# EAGLE design main_board (EAGLE 9.6.2)

## Sheet 1 of 2
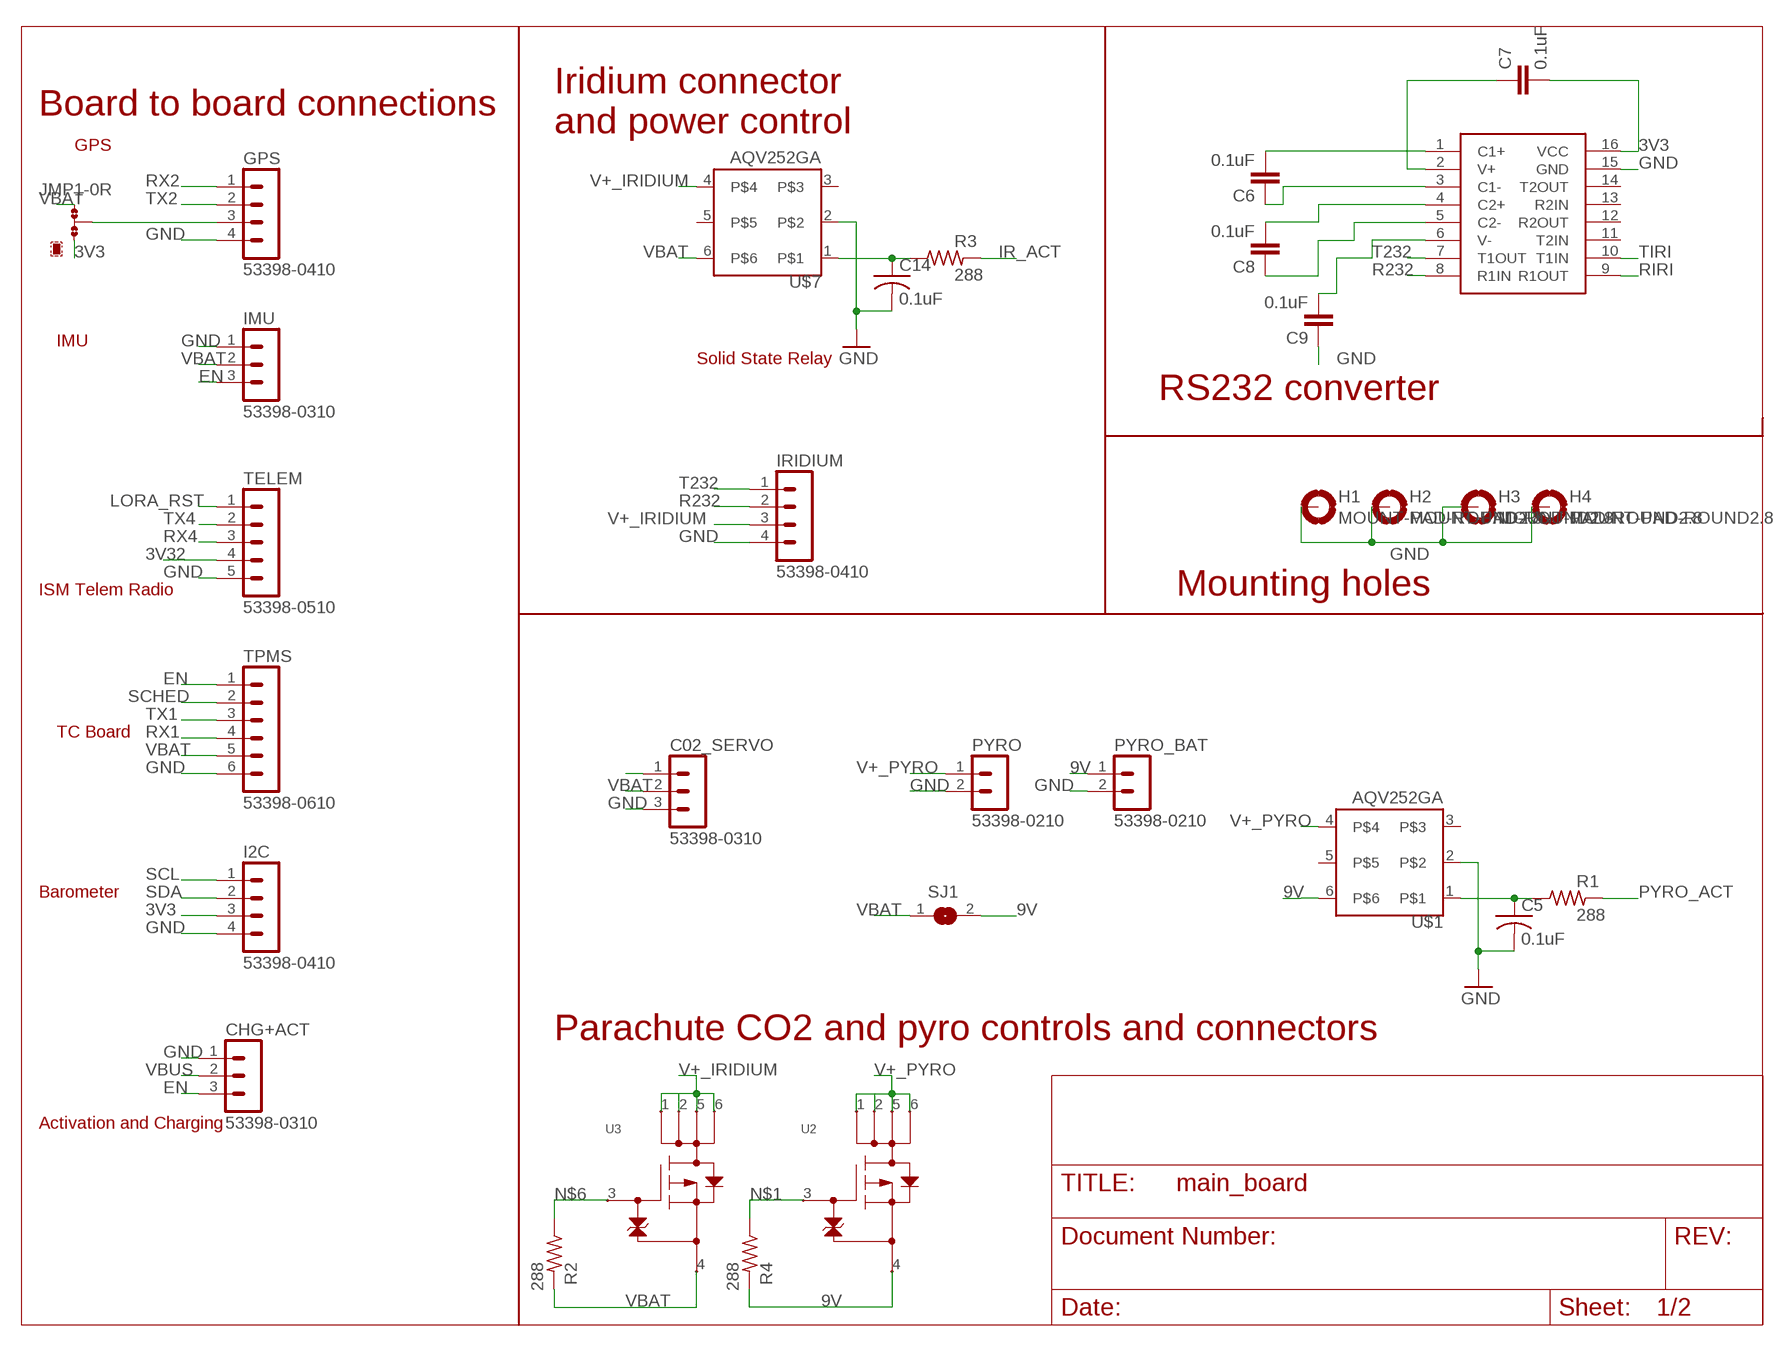
[diagram p0: schematic, sheet 1]

### Parts
C02_SERVO  53398-0310  [53398-0310]
C5  0.1uF  C-USC0603  [C0603]
C6  0.1uF  C-EUC0603  [C0603]
C7  0.1uF  C-EUC0603  [C0603]
C8  0.1uF  C-EUC0603  [C0603]
C9  0.1uF  C-EUC0603  [C0603]
C14  0.1uF  C-USC0603  [C0603]
CHG+ACT  53398-0310  [53398-0310]
GPS  53398-0410  [53398-0410]
H1  MOUNT-PAD-ROUND2.8  [2,8-PAD]
H2  MOUNT-PAD-ROUND2.8  [2,8-PAD]
H3  MOUNT-PAD-ROUND2.8  [2,8-PAD]
H4  MOUNT-PAD-ROUND2.8  [2,8-PAD]
I2C  53398-0410  [53398-0410]
IMU  53398-0310  [53398-0310]
IRIDIUM  53398-0410  [53398-0410]
JMP1  0R-JUMPA  [A0R-JMP]
PYRO  53398-0210  [53398-0210]
PYRO_BAT  53398-0210  [53398-0210]
R1  288  R-US_R0603  [R0603]
R2  288  R-US_R0603  [R0603]
R3  288  R-US_R0603  [R0603]
R4  288  R-US_R0603  [R0603]
SJ1  SJ  [SJ]
TELEM  53398-0510  [53398-0510]
TPMS  53398-0610  [53398-0610]
U2  SSM6J414TU  [UF6_TOS]
U3  SSM6J414TU  [UF6_TOS]
U$1  AQV252GA  [DIP6]
U$2  UM3232EEAE  [RQ_16_ADI]
U$7  AQV252GA  [DIP6]

### Nets
3V3: C7.2 I2C.3 JMP1.3 U$2.16(VCC) ; also sheet 2
3V32: TELEM.4 ; also sheet 2
9V: PYRO_BAT.1 R4.2 SJ1.2 U2.4 U$1.6
CO2_SERVO: C02_SERVO.1 ; also sheet 2
EN: CHG+ACT.3 IMU.3 TPMS.1 ; also sheet 2
GND [gnd]: C02_SERVO.3 C5.2 C9.1 C14.2 CHG+ACT.1 GPS.4 H1.B2,8(MOUNT) H2.B2,8(MOUNT) H3.B2,8(MOUNT) H4.B2,8(MOUNT) I2C.4 IMU.1 IRIDIUM.4 PYRO.2 PYRO_BAT.2 TELEM.5 TPMS.6 U$1.2 U$2.15(GND) U$7.2 ; also sheet 2
IR_ACT: R3.2 ; also sheet 2
LORA_RST: TELEM.1 ; also sheet 2
N$1: C5.1 R1.1 R4.1 U2.3 U$1.1
N$2: GPS.3 JMP1.2
N$5: C6.2 U$2.1(C1+)
N$6: C14.1 R2.1 R3.1 U3.3 U$7.1
N$11: C7.1 U$2.2(V+)
N$12: C6.1 U$2.3(C1-)
N$13: C8.2 U$2.4(C2+)
N$14: C8.1 U$2.5(C2-)
N$15: C9.2 U$2.6(V-)
PYRO_ACT: R1.2 ; also sheet 2
R232: IRIDIUM.2 U$2.8(R1IN)
RIRI: U$2.9(R1OUT) ; also sheet 2
RX1: TPMS.4 ; also sheet 2
RX2: GPS.1 ; also sheet 2
RX4: TELEM.3 ; also sheet 2
SCHED: TPMS.2 ; also sheet 2
SCL: I2C.1 ; also sheet 2
SDA: I2C.2 ; also sheet 2
T232: IRIDIUM.1 U$2.7(T1OUT)
TIRI: U$2.10(T1IN) ; also sheet 2
TX1: TPMS.3 ; also sheet 2
TX2: GPS.2 ; also sheet 2
TX4: TELEM.2 ; also sheet 2
V+_IRIDIUM: IRIDIUM.3 U3.1 U3.2 U3.5 U3.6 U$7.4
V+_PYRO: PYRO.1 U2.1 U2.2 U2.5 U2.6 U$1.4
VBAT: C02_SERVO.2 IMU.2 JMP1.1 R2.2 SJ1.1 TPMS.5 U3.4 U$7.6 ; also sheet 2
VBUS: CHG+ACT.2 ; also sheet 2
Unconnected: U$1.3 U$1.5 U$2.11(T2IN) U$2.12(R2OUT) U$2.13(R2IN) U$2.14(T2OUT) U$7.3 U$7.5

### Notes on the sheet
- Board to board connections
- Iridium connector 
  and power control
- GPS
- IMU
- Solid State Relay
- RS232 converter
- ISM Telem Radio | Mounting holes
- TC Board
- Barometer
- Parachute CO2 and pyro controls and connectors
- Activation and Charging

## Sheet 2 of 2
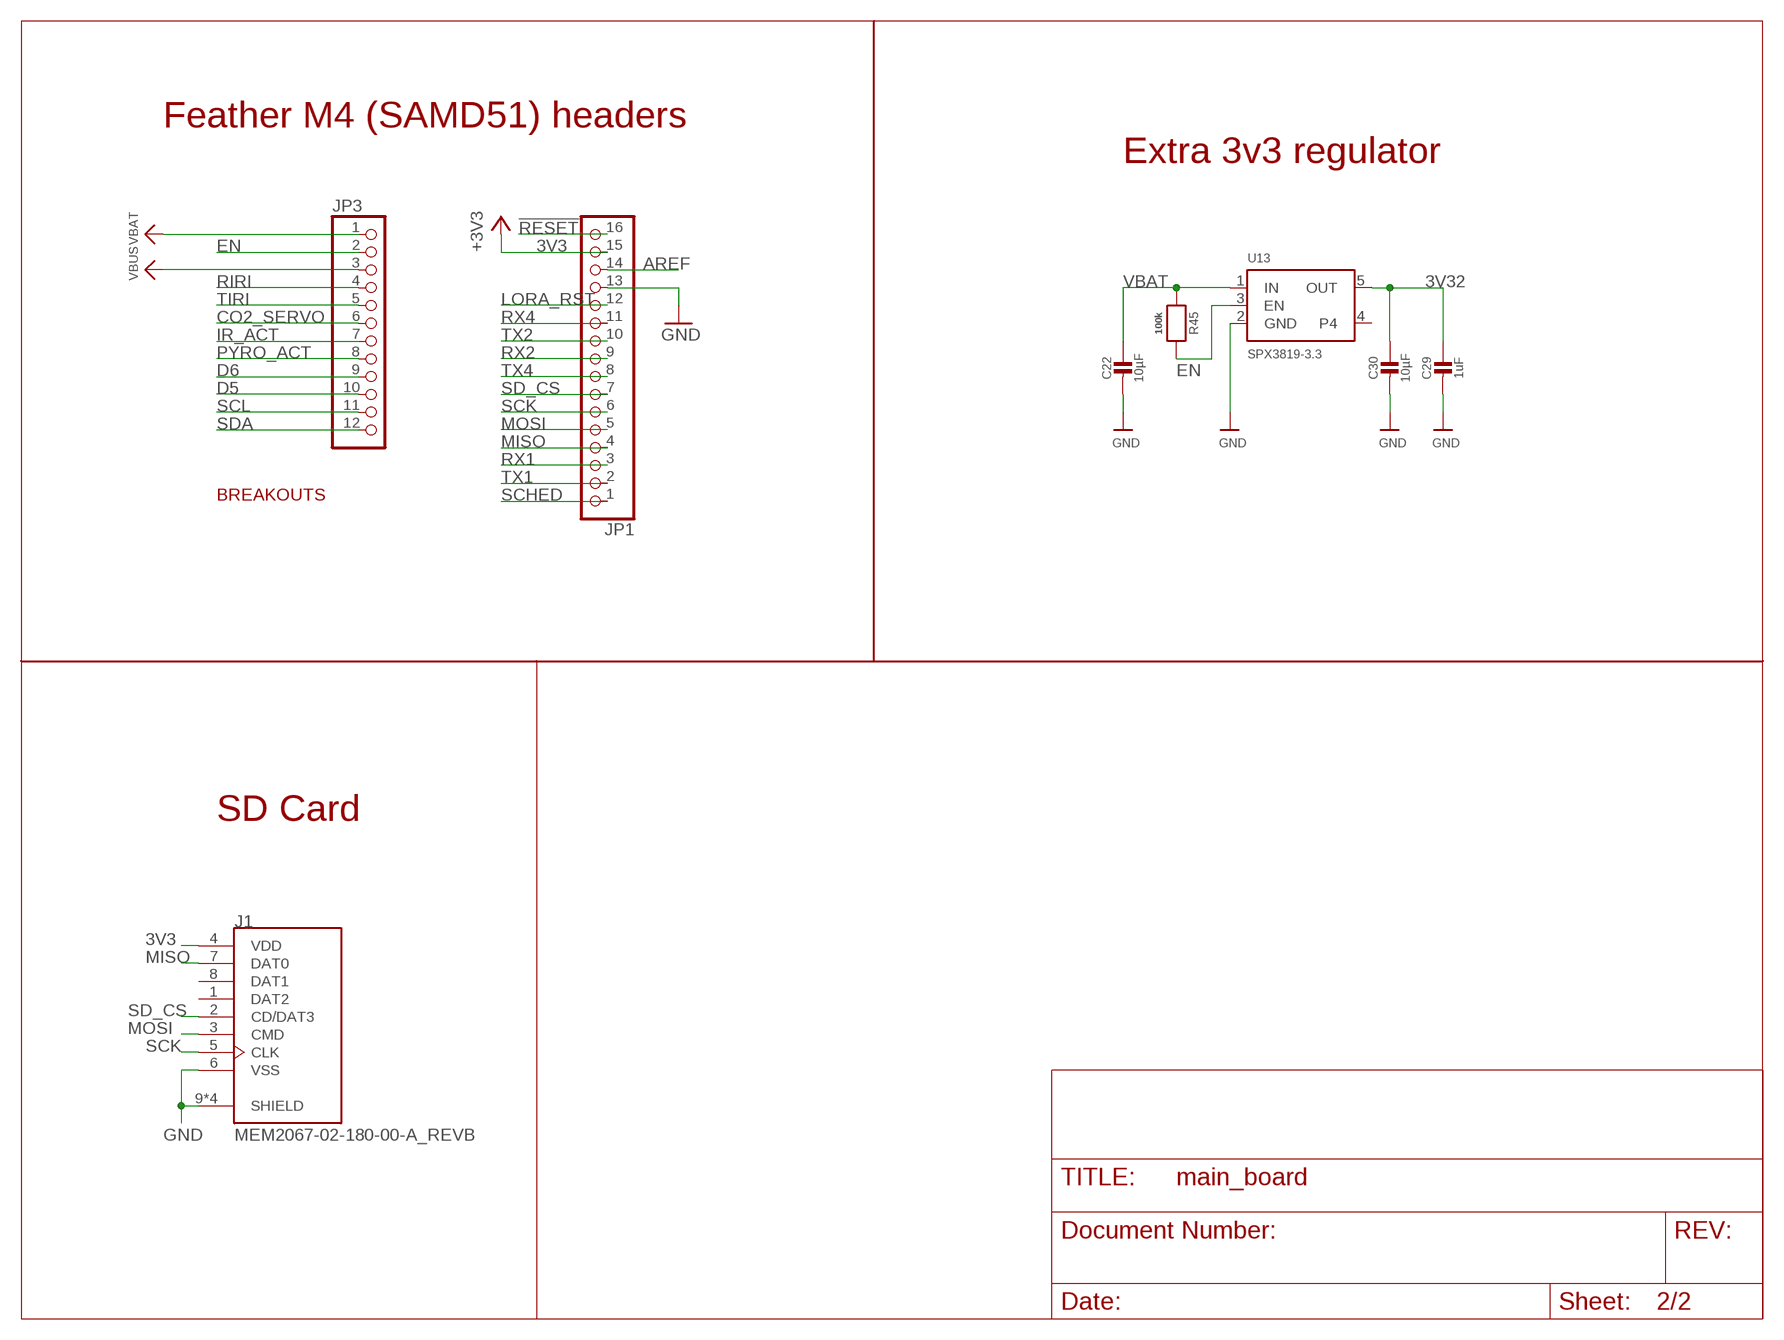
[diagram p1: schematic, sheet 2]

### Parts
C22  10µF  CAP_CERAMIC0805-NOOUTLINE  [0805-NO]
C29  1uF  CAP_CERAMIC0603_NO  [0603-NO]
C30  10µF  CAP_CERAMIC0805-NOOUTLINE  [0805-NO]
J1  MEM2067-02-180-00-A_REVB  [GCT_MEM2067-02-180-00-A_REVB]
JP1  HEADER-1X16ROUND  [1X16_ROUND]
JP3  HEADER-1X12  [1X12_ROUND]
R45  100k  RESISTOR_0603_NOOUT  [0603-NO]
U13  SPX3819-3.3  VREG_SOT23-5  [SOT23-5]

### Nets
3V3: J1.4(VDD) JP1.15 ; supply symbol labelled +3V3 ; also sheet 1
3V32: C29.1 C30.1 U13.5(OUT) ; also sheet 1
!RESET: JP1.16
AREF: JP1.14
CO2_SERVO: JP3.6 ; also sheet 1
D5: JP3.10
D6: JP3.9
EN: JP3.2 R45.2 U13.3(EN) ; also sheet 1
GND [gnd]: C22.2 C29.2 C30.2 J1.6(VSS) J1.9(SHIELD) J1.10(SHIELD) J1.11(SHIELD) J1.12(SHIELD) JP1.13 U13.2(GND) ; also sheet 1
IR_ACT: JP3.7 ; also sheet 1
LORA_RST: JP1.12 ; also sheet 1
MISO: J1.7(DAT0) JP1.4
MOSI: J1.3(CMD) JP1.5
PYRO_ACT: JP3.8 ; also sheet 1
RIRI: JP3.4 ; also sheet 1
RX1: JP1.3 ; also sheet 1
RX2: JP1.9 ; also sheet 1
RX4: JP1.11 ; also sheet 1
SCHED: JP1.1 ; also sheet 1
SCK: J1.5(CLK) JP1.6
SCL: JP3.11 ; also sheet 1
SD_CS: J1.2(CD/DAT3) JP1.7
SDA: JP3.12 ; also sheet 1
TIRI: JP3.5 ; also sheet 1
TX1: JP1.2 ; also sheet 1
TX2: JP1.10 ; also sheet 1
TX4: JP1.8 ; also sheet 1
VBAT: C22.1 JP3.1 R45.1 U13.1(IN) ; also sheet 1
VBUS: JP3.3 ; also sheet 1
Unconnected: J1.1(DAT2) J1.8(DAT1) U13.4

### Notes on the sheet
- Feather M4 (SAMD51) headers
- Extra 3v3 regulator
- BREAKOUTS
- SD Card

## Library data of the parts
C02_SERVO CHG+ACT IMU = con-molex-picoblade:53398-0310: HEADER
C5 C14 = adafruit:C-US: CAPACITOR, American symbol
C6-C9 = rcl:C-EU: CAPACITOR, European symbol; SPICEPREFIX: C
C22 C29 C30 = microbuilder:CAP_CERAMIC: Ceramic Capacitors For new designs, use the packages preceded by an '_' character since they are more reliable: The following footprints should be used on most boards: _0402 - Standard footprint for regular board layouts _0603 - Standard footprint for regular board layouts _0805 - Standard footprint for regular board layouts _1206 - Standard footprint for regular board layouts For extremely tight-pitch boards where space is at a premium, the following 'micro-pitch' footprints can be used (smaller pads, no silkscreen outline, etc.): _0402MP - Micro-pitch footprint for very dense/compact boards _0603MP - Micro-pitch footprint for very dense/compact boards _0805MP - Micro-pitch footprint for very dense/compact boards _1206MP - Micro-pitch footprint for very dense/compact boards
GPS I2C IRIDIUM = con-molex-picoblade:53398-0410: HEADER
H1-H4 = holes:MOUNT-PAD-ROUND: MOUNTING PAD, round
J1 = MEM20267:MEM2067-02-180-00-A_REVB: Micro SD Memory Card ConnectorSMT, Hinged, 1.80mm Profile Check prices <https://pricing.snapeda.com/parts/MEM2067-02-180-00-A/Global%20Connector%20Technology/view-part?ref=eda>; AVAILABILITY: In Stock; DESCRIPTION: 8 Position Card Connector microSD Surface Mount, Right Angle Gold; MF: Global Connector Technology; MP: MEM2067-02-180-00-A; PACKAGE: None; PRICE: None; PURCHASE-URL: https://pricing.snapeda.com/search/part/MEM2067-02-180-00-A/?ref=eda
JMP1 = jump-0r-smd:0R-JUMP: SMD 0R 0805 Jumper
JP1 = microbuilder:HEADER-1X16: PIN HEADER
JP3 = microbuilder:HEADER-1X12
PYRO PYRO_BAT = con-molex-picoblade:53398-0210: HEADER
R1-R4 = adafruit:R-US_: RESISTOR, American symbol
R45 = microbuilder:RESISTOR: Resistors For new designs, use the packages preceded by an '_' character since they are more reliable: The following footprints should be used on most boards: _0402 - Standard footprint for regular board layouts _0603 - Standard footprint for regular board layouts _0805 - Standard footprint for regular board layouts _1206 - Standard footprint for regular board layouts For extremely tight-pitch boards where space is at a premium, the following 'micro-pitch' footprints can be used (smaller pads, no silkscreen outline, etc.): _0402MP - Micro-pitch footprint for very dense/compact boards _0603MP - Micro-pitch footprint for very dense/compact boards _0805MP - Micro-pitch footprint for very dense/compact boards _1206MP - Micro-pitch footprint for very dense/compact boards
SJ1 = jumper:SJ: SMD solder JUMPER
TELEM = con-molex-picoblade:53398-0510: HEADER
TPMS = con-molex-picoblade:53398-0610: HEADER
U2 U3 = ssm6j414tu:SSM6J414TU; COPYRIGHT: Copyright (C) 2021 Ultra Librarian. All rights reserved.; DIGI-KEY_PART_NUMBER_1: SSM6J414TULF(TCT-ND; DIGI-KEY_PART_NUMBER_2: SSM6J414TULF(TDKR-ND; DIGI-KEY_PART_NUMBER_3: SSM6J414TULF(TTR-ND; DIGI-KEY_PART_NUMBER_4: SSM6J414TULFCT-ND; DIGI-KEY_PART_NUMBER_5: SSM6J414TULFDKR-ND; DIGI-KEY_PART_NUMBER_6: SSM6J414TULFTR-ND; MANUFACTURER_PART_NUMBER: SSM6J414TU; MFR_NAME: Toshiba Electronic Devices & Storage Co.
U13 = microbuilder:VREG_SOT23-5: SOT23-5 Fixed Voltage Regulators Part Current Out V Out V In V Dropout θJA (°C/W) TJ (°C) Digikey Part No. ADP121 150mA 3.3V 3.4-5.5V 0.09V @ 150mA -- -- ADP121-AUJZ33R7CT-ND ADP121 150mA 3.0V 3.1-5.5V 0.09V @ 150mA -- -- ADP121-AUJZ30R7CT-ND ADP122 300mA 3.3V 3.4-5.5V 0.085V @ 300mA -- -- ADP122AUJZ-3.3-R7CT-ND ADP1712 300mA 3.3V 3.5-5.5V 0.17V @ 300mA -- -- ADP1712AUJZ-3.3-R7TR-ND AP7311 (Low Cost) 150mA 3.3V 3.5-6V 0.15V @ 150mA -- -- AP7311-33WG-7DICT-ND LD39015M18R 150mA 1.8V 1.9V-5.5V 0.08V @ 100mA -- -- 497-6977-1-ND LP2985A-33DBVR 150mA 3.3V 3.3-16V 0.28V @ 150mA 206 150 296-18479-1-ND MCP1824T-3302E/OT 300mA 3.3V 3.5V-6V 0.2V @ 300mA -- -- MCP1824T-3302E/OTCT-ND MIC5205-2.5YM5 TR 150mA 2.5V 2.7-16V 0.165V @ 150mA -- -- 576-1257-2-ND MIC5205-3.0YM5 TR 150mA 3.0V 3.2V-16V 0.165V @ 150mA -- -- 576-1258-2-ND MIC5205-3.3YM5 TR 150mA 3.3V 3.5V-16V 0.165V @ 150mA -- -- 576-1259-2-ND TPS780330220 150mA 3.3V+2.2V 3.6-5.5V 250mV Max -- -- 296-23332-1-ND TDA3663/N1,135 100mA 3.3V 3.5-45V 0.18V @ 50mA -- -- 568-5343-1-ND Max operating temp can be calculated using θJA, TJ (max junction temperature), and power in watts. Set the "Maximum Ambient Temperature" until it reaches TJ ("Max Junction Temperature"), which is the absolute limit for safe use of the regulator: Heat Sink Temperature Calculator <http://www.daycounter.com/Calculators/Heat-Sink-Temperature-Calculator.phtml> For example, With 12V source into a 3.3V LP2985 and a 30mA load, we are dissipating (12V-3.3V) * 0.03A = 0.261W. With a θJA of 206 °C/W, a TJ of 150°C, and 261mW we can safely use the chip without a heat sink up to 75°C (=147.1°C Junction Temperature).
U$1 U$7 = TI_radio:AQV252GA
U$2 = ADM310:UM3232EEAE

## Net classes
1 power: width 0.305 mm
2 gnd: width 0.254 mm

## Board
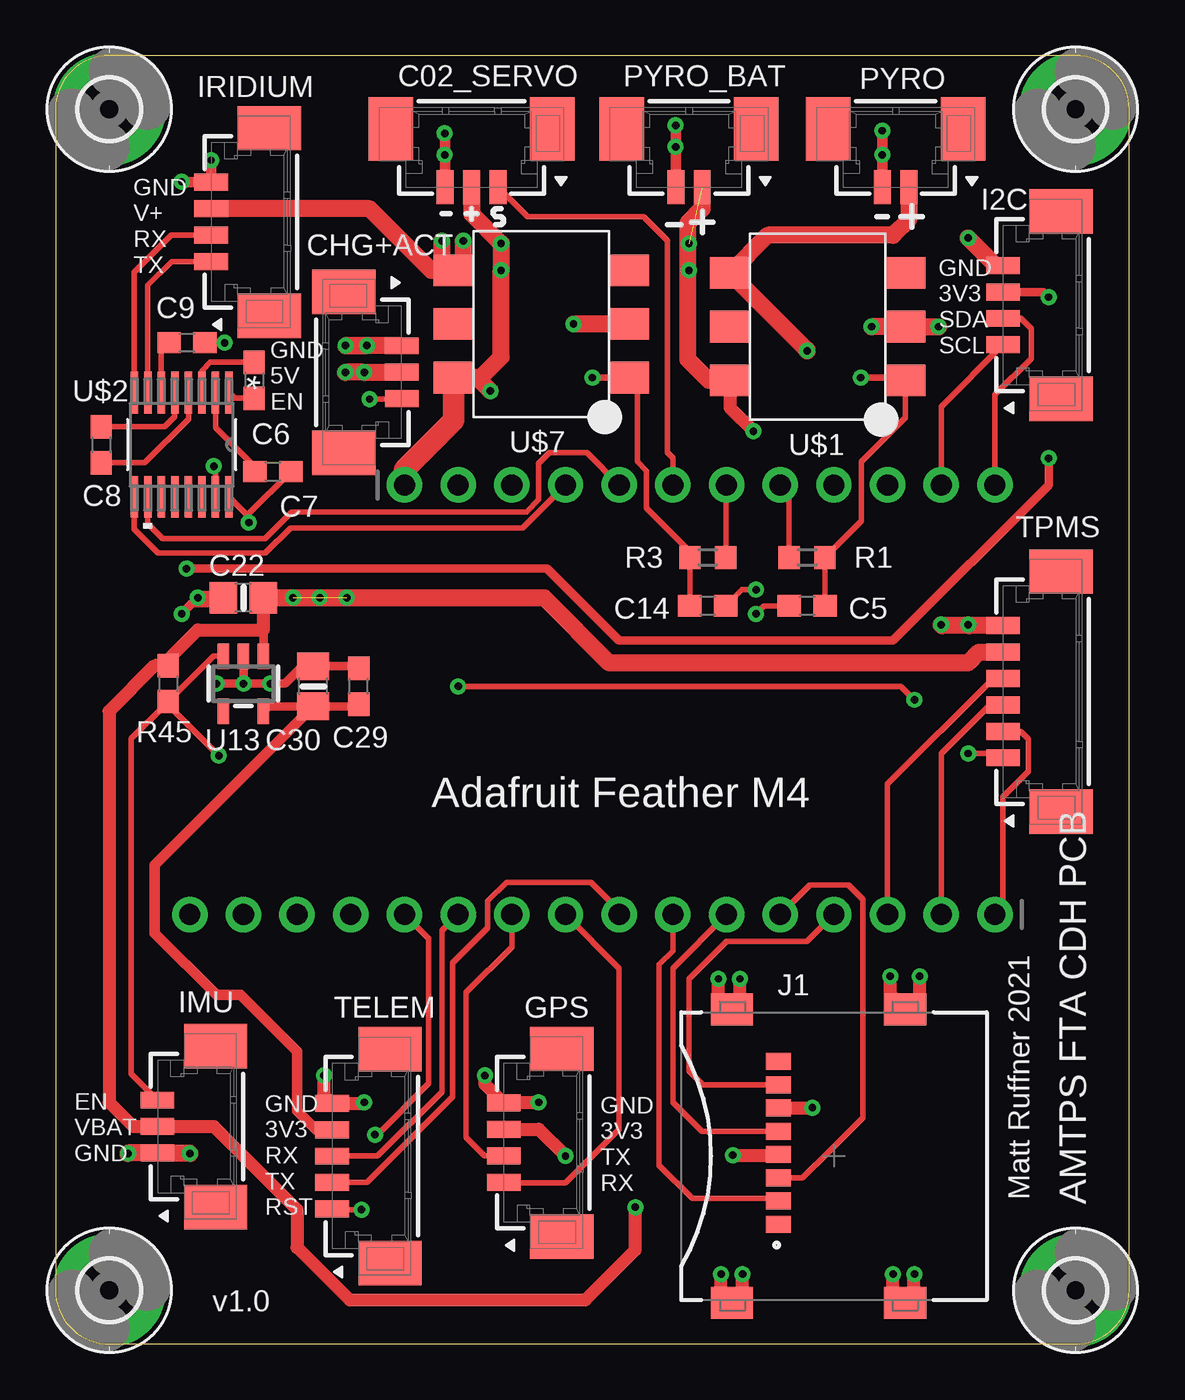
[diagram p2: board, top side]
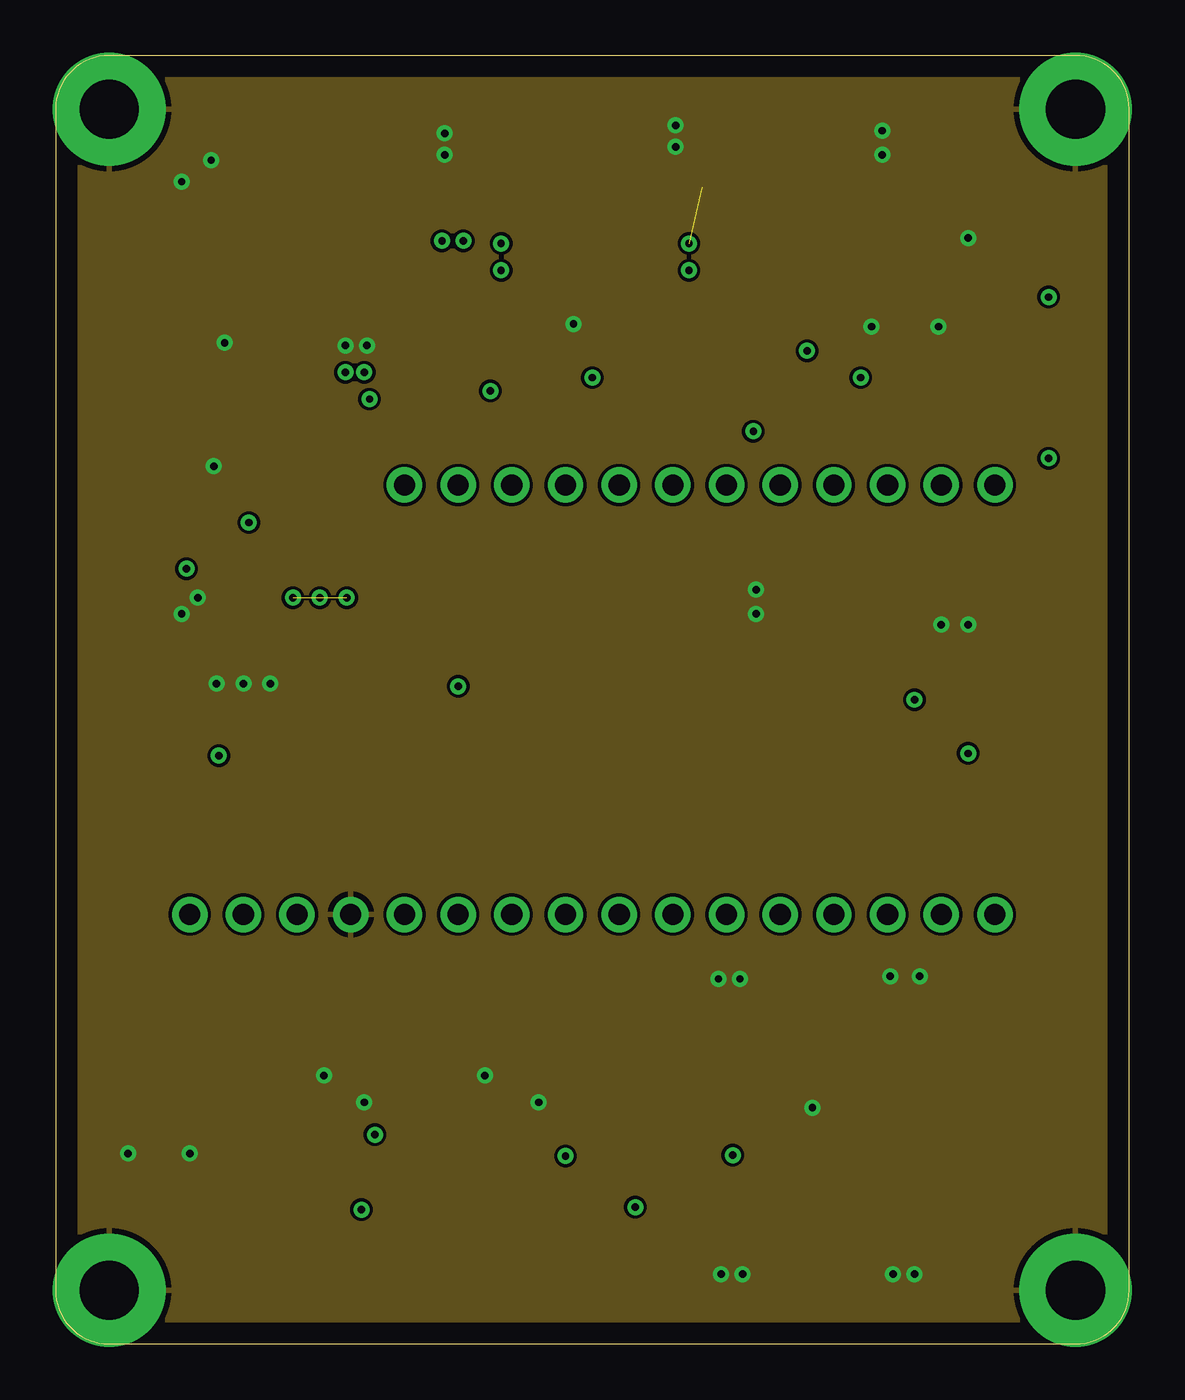
[diagram p3: board, inner layer Route2]
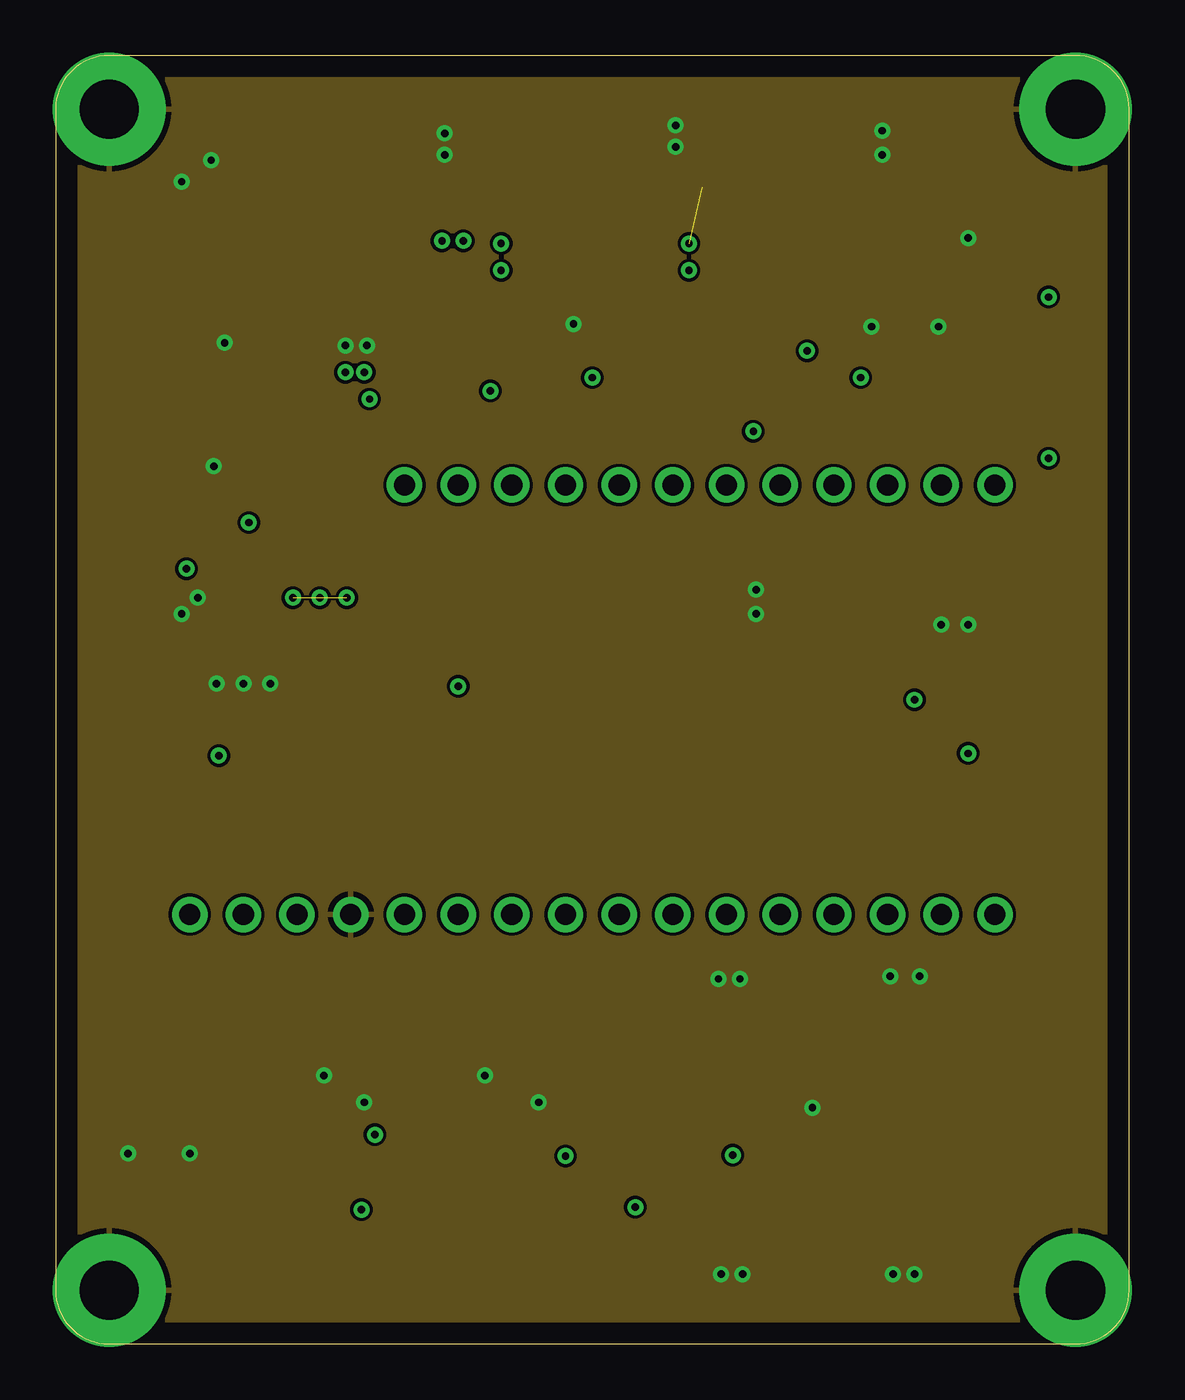
[diagram p4: board, inner layer Route15]
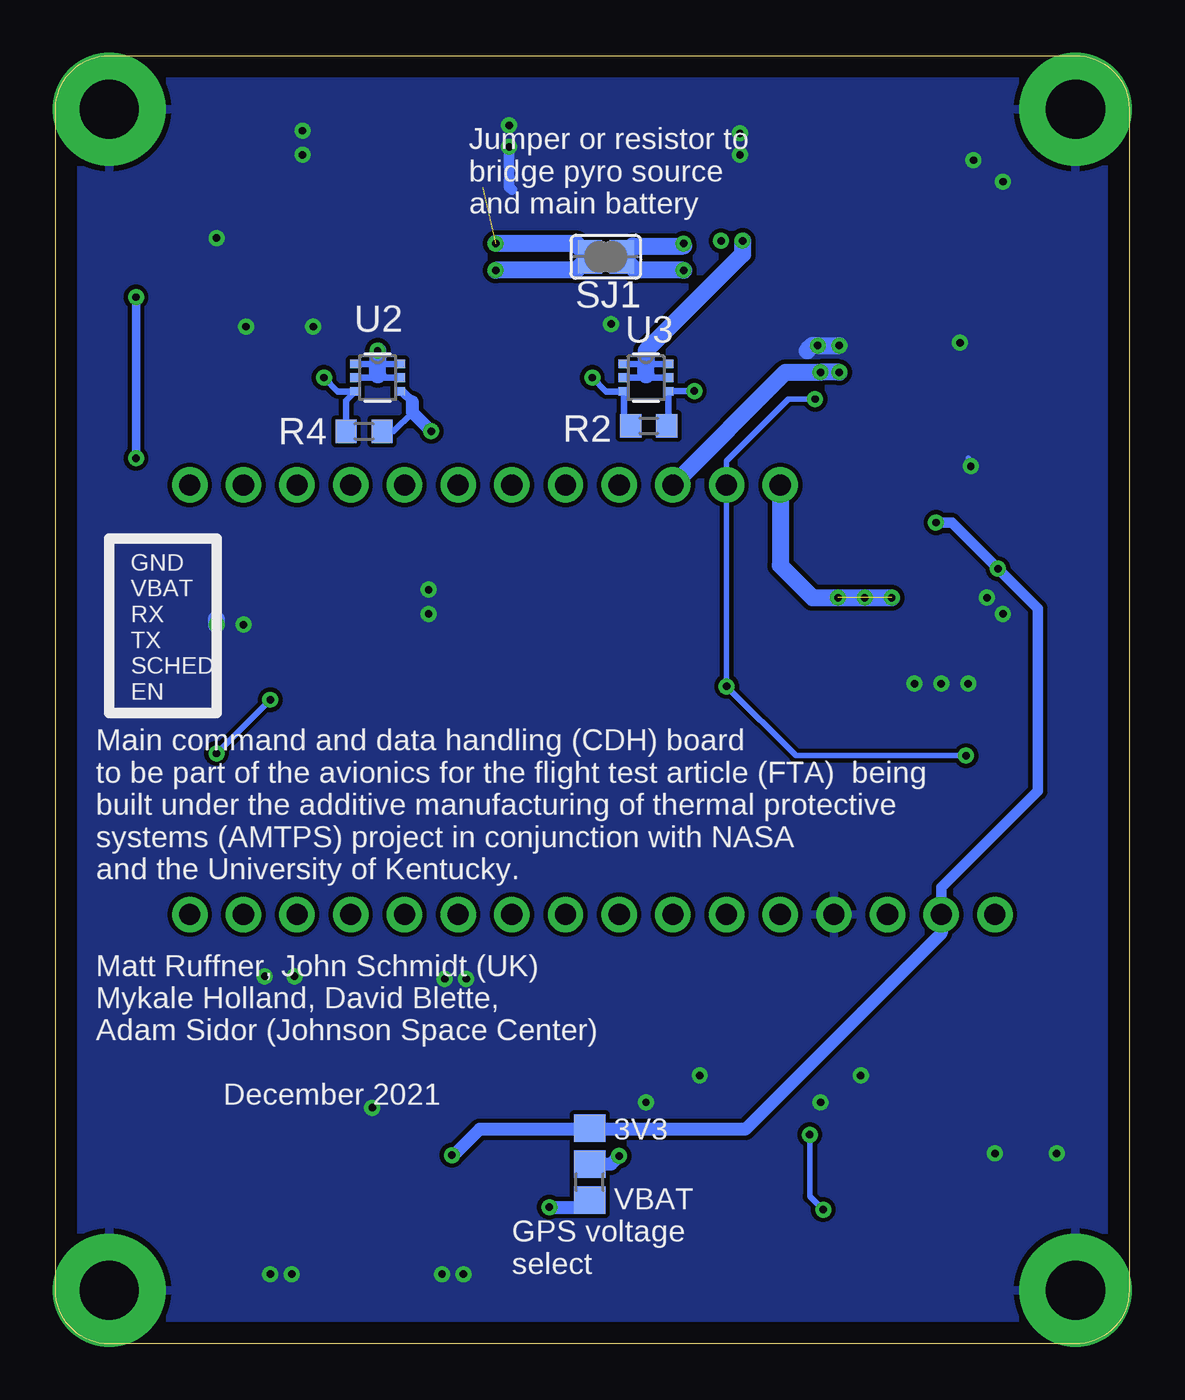
[diagram p5: board, bottom side, seen from below]

Size 50.8 x 60.96 mm. Coordinates in mm from the lower left corner, seen from the top.
Outline: 0,58.42 0,2.54 arc90 2.54,0 48.26,0 arc90 50.8,2.54 50.8,58.42 arc90 48.26,60.96 2.54,60.96 arc90 0,58.42
Copper layers (1+2*15+16): Top 0.035mm / dielectric 1.5mm / Route2 0.035mm / dielectric 0.15mm / Route15 0.035mm / dielectric 0.2mm / Bottom 0.035mm
Design rules "default *": minimum track width 6mil, minimum drill 0.35mm, track to track 6mil, track to pad 6mil, pad to pad 6mil, via to via 6mil, smd to smd 6mil, copper to edge 40mil, drill to drill 6mil, minimum pad ring 10mil, minimum via ring 8mil, stop-mask expansion 4mil, vias tented up to drill 14mil, thermal gap 10mil

### Footprints (pad centres in the part's own frame; a part is rotated, then mirrored left to right if it is on the bottom)
53398-0310 = smd 0.8 x 1.6: 1 1.25,0; 2 0,0; 3 -1.25,0 | smd 2.1 x 3: M1 3.81,2.75; M2 -3.81,2.75
C0603 = smd 1.1 x 1: 1 -0.85,0; 2 0.85,0
0805-NO = smd 1.3 x 1.5: 1 -0.95,0; 2 0.95,0
0603-NO = smd 1.1 x 1: 1 -0.85,0; 2 0.85,0
53398-0410 = smd 0.8 x 1.6: 1 1.875,0; 2 0.625,0; 3 -0.625,0; 4 -1.875,0 | smd 2.1 x 3: M1 4.435,2.75; M2 -4.435,2.75
2,8-PAD = drill 2.8 pad 5.334: B2,8 0,0
GCT_MEM2067-02-180-00-A_REVB = smd 0.8 x 1.2: 1 3.225,-2.625; 2 2.125,-2.625; 3 1.025,-2.625; 4 -0.075,-2.625; 5 -1.175,-2.625; 6 -2.275,-2.625; 7 -3.375,-2.625; 8 -4.475,-2.625 | smd 1.5 x 2: 9 -6.945,-4.825; 10 -6.945,3.375; 11 6.945,3.375; 12 6.945,-4.825
A0R-JMP = smd 1.5 x 1.3: 1 0,1.7; 2 0,0; 3 0,-1.7
1X16_ROUND = drill 1 pad 1.676: 1 -19.05,0; 2 -16.51,0; 3 -13.97,0; 4 -11.43,0; 5 -8.89,0; 6 -6.35,0; 7 -3.81,0; 8 -1.27,0; 9 1.27,0; 10 3.81,0; 11 6.35,0; 12 8.89,0; 13 11.43,0; 14 13.97,0; 15 16.51,0; 16 19.05,0
1X12_ROUND = drill 1 pad 1.676: 1 -13.97,0; 2 -11.43,0; 3 -8.89,0; 4 -6.35,0; 5 -3.81,0; 6 -1.27,0; 7 1.27,0; 8 3.81,0; 9 6.35,0; 10 8.89,0; 11 11.43,0; 12 13.97,0
53398-0210 = smd 0.8 x 1.6: 1 0.625,0; 2 -0.625,0 | smd 2.1 x 3: M1 3.185,2.75; M2 -3.185,2.75
R0603 = smd 1 x 1.1: 1 -0.85,0; 2 0.85,0
SJ = smd 1.168 x 1.6: 1 -0.762,0; 2 0.762,0
53398-0510 = smd 0.8 x 1.6: 1 2.5,0; 2 1.25,0; 3 0,0; 4 -1.25,0; 5 -2.5,0 | smd 2.1 x 3: M1 5.06,2.75; M2 -5.06,2.75
53398-0610 = smd 0.8 x 1.6: 1 3.125,0; 2 1.875,0; 3 0.625,0; 4 -0.625,0; 5 -1.875,0; 6 -3.125,0 | smd 2.1 x 3: M1 5.685,2.75; M2 -5.685,2.75
UF6_TOS = smd 0.508 x 0.406: 1 -1.054,0.65; 2 -1.054,0; 3 -1.054,-0.65; 4 1.054,-0.65; 5 1.054,0; 6 1.054,0.65
SOT23-5 = smd 0.55 x 1.2: 1 -0.95,-1.3; 2 0,-1.3; 3 0.95,-1.3; 4 0.95,1.3; 5 -0.95,1.3
DIP6 = smd 1.9 x 1.5: 1 -4.15,2.54; 2 -4.15,0; 3 -4.15,-2.54; 4 4.15,-2.54; 5 4.15,0; 6 4.15,2.54
RQ_16_ADI = smd 1.981 x 0.351: 1 -2.465,2.24; 2 -2.465,1.6; 3 -2.465,0.96; 4 -2.465,0.32; 5 -2.465,-0.32; 6 -2.465,-0.96; 7 -2.465,-1.6; 8 -2.465,-2.24; 9 2.465,-2.24; 10 2.465,-1.6; 11 2.465,-0.96; 12 2.465,-0.32; 13 2.465,0.32; 14 2.465,0.96; 15 2.465,1.6; 16 2.465,2.24

### Placement (x,y rotation side)
C02_SERVO  19.68,54.74 0 top
C5  35.56,34.92 180 top
C6  9.4,45.59 270 top
C7  10.29,41.27 0 top
C8  2.16,42.55 270 top
C9  6.22,47.37 180 top
C14  30.86,34.92 0 top
C22  8.89,35.31 180 top
C29  14.35,31.11 90 top
C30  12.19,31.11 90 top
CHG+ACT  16.38,45.97 90 top
GPS  21.21,9.53 270 top
H1  2.54,2.54 0 top
H2  48.26,2.54 0 top
H3  2.54,58.42 0 top
H4  48.26,58.42 0 top
I2C  44.83,49.15 270 top
IMU  4.83,10.29 270 top
IRIDIUM  7.37,53.09 270 top
J1  36.83,8.89 270 top
JMP1  25.53,8.51 180 bottom
JP1  25.4,20.32 180 top
JP3  30.48,40.64 0 top
PYRO  39.75,54.74 0 top
PYRO_BAT  29.97,54.74 0 top
R1  35.56,37.21 180 top
R2  22.73,43.43 0 bottom
R3  30.86,37.21 0 top
R4  36.2,43.18 0 bottom
R45  5.33,31.24 270 top
SJ1  24.77,51.44 180 bottom
TELEM  13.08,8.89 270 top
TPMS  44.83,30.86 270 top
U2  35.56,45.72 0 bottom
U3  22.86,45.72 0 bottom
U13  8.89,31.24 180 top
U$1  36.07,48.13 180 top
U$2  5.97,42.55 270 top
U$7  22.99,48.26 180 top

### Tracks (layer width: path | path; a pad name or v marks a point on that pad's centre or on a via)
3V3  (via drill 0.35)
  Top 0.254: C7.2 9.14,39.28 v9.14,38.86
  Top 0.305: v9.14,38.86 9.14,39.15 U$2.16
  Top 0.406: v6.2,36.68 23.26,36.68 26.67,33.27 39.62,33.27 46.99,40.64 v46.99,41.91 | v46.99,49.53 46.75,49.77 I2C.3
  Top 0.61: J1.4 34.17,8.94 v32.05,8.94
  Bottom 0.406: v46.99,41.91 v46.99,49.53
  Bottom 0.508: JP1.15 8.89,21.59 4.32,26.16 4.32,34.8 v6.2,36.68 8.38,38.86 v9.14,38.86
  Bottom 0.61: JP1.15 8.89,19.43 18.16,10.16 25.48,10.16 | 25.48,10.16 30.73,10.16 31.96,8.94 v32.05,8.94 | JMP1.3 25.48,10.16
3V32
  Top 0.406: U13.5 10.06,30.16 C30.1 14.25,30.16 C29.1
  Top 0.508: C30.1 4.7,22.67 4.7,19.43 7.62,16.51 8.76,16.51 11.43,13.84 11.43,11.03 12.32,10.14 TELEM.4
9V  (via drill 0.35)  (1 unrouted)
  Top 0.61: U$1.6 31.92,44.28 v33.02,43.18
  Top 0.813: PYRO_BAT.1 30.6,53.71 29.9,53.02 29.9,46.59 30.9,45.59 U$1.6
  Bottom 0.305: R4.2 34.8,43.18 33.91,44.07
  Bottom 0.406: 33.91,44.58 34.4,45.07 U2.4
  Bottom 0.61: v33.02,43.18 33.91,44.07 33.91,44.58
  Bottom 0.813: v29.97,52.07 26.16,52.07 SJ1.2 26.16,50.8 v29.97,50.8
CO2_SERVO
  Top 0.254: JP3.6 29.21,41.91 28.96,42.16 28.96,52.2 27.81,53.34 22.33,53.34 C02_SERVO.1
EN  (via drill 0.35)
  Top 0.254: 5.25,30.31 3.58,28.64 3.58,12.78 IMU.3 | 5.25,30.31 R45.2 7.48,32.54 U13.3 | v19.05,31.11 40.01,31.11 v40.64,30.48 | v43.18,27.94 44.63,27.94 TPMS.1 | v7.72,27.84 5.25,30.31 | CHG+ACT.3 16.36,44.7 v14.86,44.7
  Bottom 0.254: v7.72,27.84 15.77,27.84 v19.05,31.11 JP3.2 19.05,41.78 16.13,44.7 v14.86,44.7 | v40.64,30.48 v43.18,27.94
GND  (via drill 0.35)
  Top 0.254: v33.15,35.69 32.47,35.69 C14.2 | C5.2 33.53,34.92 v33.15,34.54 | C9.1 v8,47.37 | U$2.15 7.57,41.45 v7.49,41.53
  Top 0.406: U13.2 v8.89,31.24 | v8.89,31.24 v10.16,31.24 10.86,31.24 11.68,32.06 C30.2 14.25,32.06 C29.2 | v8.89,31.24 v7.62,31.24 | v6.73,35.31 6.86,35.43 7.81,35.43 C22.2 7.69,35.05 6.48,35.05 v5.97,34.54
  Top 0.508: v5.97,54.99 6,54.96 IRIDIUM.4 v7.37,56.01 | v39.12,56.26 v39.13,56.25 PYRO.2 v39.13,57.39 v39.12,57.4 | v29.34,56.64 v29.35,56.63 PYRO_BAT.2 29.35,57.65 v29.34,57.66 | v18.41,56.26 18.43,56.24 C02_SERVO.3 18.43,57.26 v18.41,57.28
  Top 0.61: v14.61,11.43 14.56,11.39 TELEM.5 12.7,11.77 v12.7,12.7 | v20.32,12.7 20.32,12.29 GPS.4 21.24,11.43 v22.86,11.43 | J1.6 35.8,11.16 v35.81,11.18 | v32.38,17.27 32.38,16.21 J1.9 31.37,16.47 v31.37,17.27 | v39.5,17.4 39.5,16.54 J1.10 40.89,16.52 v40.89,17.4 | v40.64,3.3 40.59,3.25 40.59,2.33 J1.11 40.06,2.09 39.62,2.09 v39.62,3.3 | v32.51,3.3 32.51,2.45 J1.12 31.5,2.45 v31.5,3.3
  Top 0.813: v43.18,34.04 43.23,33.99 TPMS.6 41.96,33.99 v41.91,34.04 | v41.78,48.13 U$1.2 v38.61,48.13 | I2C.4 44.48,51.02 v43.18,52.32 | U$7.2 v24.51,48.26 | v6.35,9.02 6.33,9.04 IMU.1 3.45,9.04 v3.43,9.02 | CHG+ACT.1 13.74,47.22 13.76,47.24 v14.73,47.24
  Bottom 0.254: v7.49,41.53 7.62,41.66 7.62,41.91
  Bottom 0.508: v29.34,56.64 29.34,54.74 29.21,54.61
  Bottom 0.813: v43.18,34.04 43.18,34.29 | 15.24,46.99 14.99,47.24 v14.73,47.24 v13.72,47.24
  pour Bottom (isolate 0.203): 0,63.5 50.8,63.5 53.34,60.96 53.34,0 52.07,-1.27 50.8,-1.27 -1.27,-1.27 -1.27,62.23
  pour Route2: -1.27,63.5 54.61,63.5 54.61,-2.54 53.34,-3.81 -1.27,-3.81 -2.54,-2.54 -2.54,62.23
  pour Route15: -3.81,63.5 52.07,63.5 52.07,-2.54 50.8,-3.81 -3.81,-3.81 -5.08,-2.54 -5.08,62.23
IR_ACT
  Top 0.254: R3.2 31.71,40.6 JP3.7
LORA_RST  (via drill 0.35)
  Top 0.254: TELEM.1 13.04,6.35 v14.48,6.35 | JP1.12 17.65,19.18 17.65,12.32 15.24,9.91 v15.11,9.91
  Bottom 0.254: v15.11,9.91 15.11,6.99 v14.48,6.35
MISO
  Top 0.254: JP1.4 35.56,19.05 31.75,19.05 29.96,17.26 29.96,12.92 30.63,12.25 34.19,12.25 J1.7
MOSI
  Top 0.254: JP1.5 35.69,21.72 37.52,21.72 38.2,21.04 38.2,10.7 36.62,9.12 36.61,9.12 35.35,7.87 J1.3
N$1  (via drill 0.35)
  Top 0.254: C5.1 R1.1 38.12,38.93 38.12,41.74 40.22,43.83 U$1.1
  Top 0.305: v38.1,45.72 40.09,45.72 U$1.1
  Bottom 0.305: v38.1,45.72 37.45,45.07 U2.3 37.05,44.64 R4.1
N$2  (via drill 0.35)
  Top 0.61: GPS.3 22.86,10.16 v24.13,8.89
  Bottom 0.61: v24.13,8.89 24.51,8.51 JMP1.2
N$5
  Top 0.254: C6.2 8.48,44.74 U$2.1
N$6  (via drill 0.35)
  Top 0.254: U$7.1 27.53,45.32 27.53,41.74 27.96,41.31 27.96,39.54 30.01,37.5 R3.1 C14.1
  Top 0.305: v25.4,45.72 U$7.1
  Bottom 0.305: v25.4,45.72 24.75,45.07 U3.3 23.91,43.77 R2.1
N$11
  Top 0.254: C7.1 9.44,41.49 7.57,43.36 U$2.2
N$12
  Top 0.254: C6.1 7.33,46.44 6.93,46.05 U$2.3
N$13
  Top 0.254: C8.2 4.23,41.7 6.29,43.75 U$2.4
N$14
  Top 0.254: C8.1 5.17,43.4 5.65,43.88 U$2.5
N$15
  Top 0.254: U$2.6 5.01,47.01 C9.2
PYRO_ACT
  Top 0.254: JP3.8 34.71,40.22 R1.2
R232
  Top 0.254: IRIDIUM.2 5.47,52.46 3.73,50.72 U$2.8
RIRI
  Top 0.254: JP3.4 22.1,38.61 11.12,38.61 9.93,37.42 4.87,37.42 3.73,38.56 U$2.9
RX1
  Top 0.254: TPMS.4 44.77,31.42 44.3,31.42 39.37,26.5 JP1.3
RX2
  Top 0.254: JP1.9 26.67,17.78 26.67,10.16 24.13,7.62 21.24,7.62 GPS.1
RX4
  Top 0.254: JP1.11 18.29,19.56 18.29,11.94 15.24,8.89 TELEM.3
SCHED
  Top 0.254: JP1.1 44.83,20.7 44.83,25.89 46.04,27.09 46.04,28.63 45.68,28.99 TPMS.2
SCK
  Top 0.254: JP1.6 29.21,17.78 29.21,11.43 30.57,10.06 J1.5
SCL
  Top 0.254: I2C.1 41.91,44.35 JP3.11
SD_CS
  Top 0.254: JP1.7 29.21,18.61 28.55,17.95 28.55,8.46 30.13,6.88 34.09,6.88 J1.2
SDA
  Top 0.254: JP3.12 44.45,44.92 46.16,46.63 46.16,48.04 45.68,48.52 I2C.2
T232
  Top 0.254: U$2.7 4.37,50.09 5.49,51.21 IRIDIUM.1
TIRI
  Top 0.254: U$2.10 4.37,38.81 5.08,38.1 9.91,38.1 11.18,39.37 22.29,39.37 22.86,39.95 22.86,41.66 23.37,42.16 25.15,42.16 JP3.5
TX1
  Top 0.254: TPMS.3 44.21,30.24 41.91,27.94 JP1.2
TX2
  Top 0.254: JP1.10 21.59,18.8 19.43,16.64 19.43,9.78 20.31,8.9 GPS.2
TX4
  Top 0.254: TELEM.2 14.75,7.64 18.8,11.68 18.8,18.03 20.45,19.68 20.45,20.95 21.34,21.84 25.33,21.84 26.67,20.5 JP1.8
V+_IRIDIUM  (via drill 0.35)
  Top 0.813: U$7.4 17.78,50.8 14.87,53.71 IRIDIUM.3 | U$7.4 18.29,51.35 v18.29,52.2 | U$7.4 19.3,51.27 v19.3,52.2
  Bottom 0.305: U3.6 22.75,46.37 22.86,46.48 22.97,46.37 U3.1 | U3.5 22.73,45.72 22.86,45.85 22.99,45.72 U3.2
  Bottom 0.813: v18.29,52.2 18.29,51.56 22.86,46.99 22.86,46.48 22.86,45.85
V+_PYRO  (via drill 0.35)
  Top 0.813: PYRO.1 40.38,53.2 39.62,52.45 33.7,52.45 U$1.4 35.56,47.03 v35.56,46.99
  Bottom 0.305: U2.6 35.55,46.37 35.56,46.35 35.58,46.37 U2.1 | U2.5 35.43,45.72 35.56,45.85 35.69,45.72 U2.2
  Bottom 0.813: v35.56,46.99 35.56,46.35 35.56,45.85
VBAT  (via drill 0.35)  (2 unrouted)
  Top 0.406: U13.1 9.84,33.78
  Top 0.61: C22.1 9.84,33.78 6.73,33.78 5.33,32.38 R45.1 4.7,32.09 2.54,29.93 2.54,11.43 3.68,10.29 IMU.2 7.49,10.29 11.43,6.35 11.43,4.57 13.92,2.08 25.07,2.08 27.43,4.45 v27.43,6.48
  Top 0.813: C02_SERVO.2 19.68,53.47 v21.08,52.07 v21.08,50.8 21.08,46.7 20.11,45.72 U$7.6 19.94,45.72 v20.57,45.09 | C22.1 v11.24,35.31 23.11,35.31 26.19,32.23 43.18,32.23 43.69,32.74 TPMS.5
  Top 1.016: U$7.6 18.84,43.69 16.51,41.36 JP3.1
  Bottom 0.305: v20.57,45.09 21.79,45.09 U3.4 21.81,43.51 R2.2
  Bottom 0.61: v27.43,6.48 25.86,6.48 JMP1.1
  Bottom 0.813: JP3.1 16.51,36.83 14.99,35.31 v11.24,35.31 | v21.08,50.8 23.37,50.8 SJ1.1 23.5,51.94 21.08,51.94
  other vias: 12.51,35.31 13.78,35.31
VBUS  (via drill 0.35)
  Top 0.813: CHG+ACT.2 v14.61,45.97 v13.72,45.97
  Bottom 0.813: JP3.3 16.26,45.97 v14.61,45.97 v13.72,45.97

### Text on the board
tNames: GND / V+ / RX / TX | GND / 3V3 / SDA / SCL | GND / 5V / EN | Adafruit Feather M4 | Matt Ruffner 2021 | EN / VBAT / GND | GND / 3V3 / TX / RX | AMTPS FTA CDH PCB | GND / 3V3 / RX / TX / RST | v1.0
bNames: Jumper or resistor to / bridge pyro source / and main battery | GND / VBAT / RX / TX / SCHED / EN | Main command and data handling (CDH) board / to be part of the avionics for the flight test article (FTA) being / built under the additive manufacturing of thermal protective / systems (AMTPS) project in conjunction with NASA / and the University of Kentucky. / / / Matt Ruffner, John Schmidt (UK) / Mykale Holland, David Blette, / Adam Sidor (Johnson Space Center) / / December 2021 | 3V3 | VBAT | GPS voltage / select